# EAGLE design WindVane_1 (EAGLE 7.6.0)
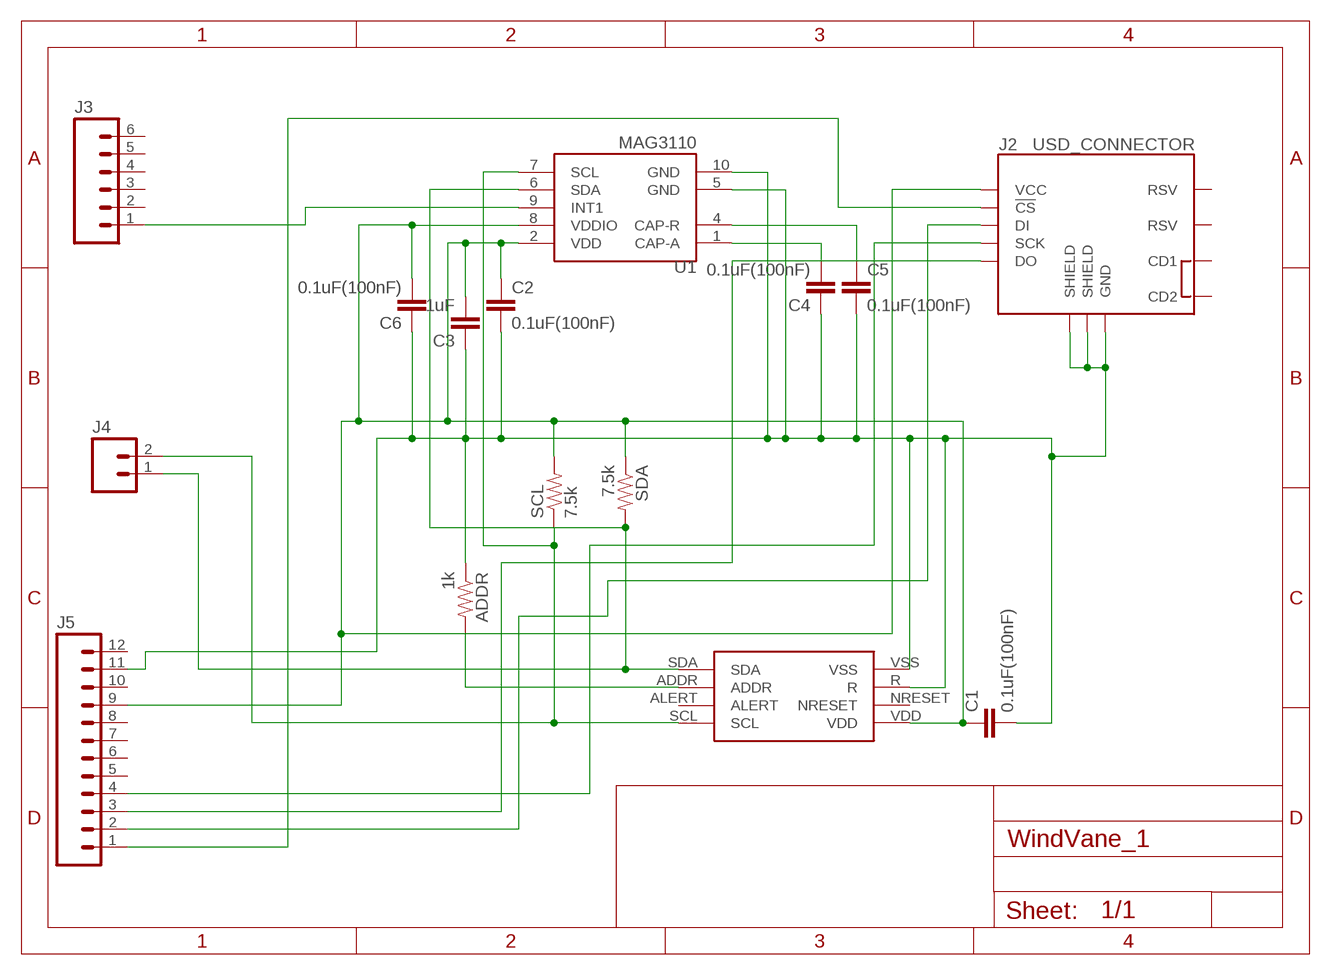
[diagram p0: schematic, sheet 1]

## Parts
ADDR  1k  RESISTOR1206  [1206]
C1  0.1uF(100nF)  CAP0603-CAP  [0603-CAP]
C2  0.1uF(100nF)  0.1UF-25V(+80/-20%)(0603)  [0603-CAP]
C3  1uF  CAP0402-CAP  [0402-CAP]
C4  0.1uF(100nF)  0.1UF-25V(+80/-20%)(0603)  [0603-CAP]
C5  0.1uF(100nF)  0.1UF-25V(+80/-20%)(0603)  [0603-CAP]
C6  0.1uF(100nF)  0.1UF-25V(+80/-20%)(0603)  [0603-CAP]
J2  USD_CONNECTOR  [MICRO-SD-SOCKET-PP]
J3  M06NO_SILK_YES_STOP  [1X06_NO_SILK_YES_STOP]
J4  M02PTH  [1X02]
J5  M121X12_NO_SILK_KIT  [1X12_NO_SILK_KIT]
SCL  7.5k  RESISTOR1206  [1206]
SDA  7.5k  RESISTOR1206  [1206]
U1  MAG3110  [DFN-10]
U$1  SHT3X-DISSURFACE_MOUNT  [SHT3X-DIS]

## Nets
N$1: J4.1 SDA.2 U1.6(SDA) U$1.SDA
N$2: J2.DI J5.2
N$3: ADDR.1 C1.2 C2.2 C3.1 C4.1 C5.2 C6.1 J2.GND J2.GND1(SHIELD) J2.GND3(SHIELD) J5.11 U1.5(GND) U1.10(GND) U$1.R U$1.VSS
N$4: J4.2 SCL.1 U1.7(SCL) U$1.SCL
N$5: ADDR.2 U$1.ADDR
N$6: C4.2 U1.1(CAP-A)
N$7: J3.1 U1.9(INT1)
N$8: C1.1 C2.1 C3.2 C6.2 J2.VCC J5.9 SCL.2 SDA.1 U1.2(VDD) U1.8(VDDIO) U$1.VDD
N$9: C5.1 U1.4(CAP-R)
N$10: J2.CS(!CS) J5.1
N$11: J2.SCLK(SCK) J5.4
N$12: J2.DO J5.3
Unconnected: J2.CD1 J2.CD2 J2.RSV1(RSV) J2.RSV2(RSV) J3.2 J3.3 J3.4 J3.5 J3.6 J5.5 J5.6 J5.7 J5.8 J5.10 J5.12 U$1.ALERT U$1.NRESET

## Library data of the parts
ADDR SCL SDA = SparkFun-Passives:RESISTOR: Resistor Basic schematic elements and footprints for 0603, 1206, and PTH resistors.
C1 = SparkFun-Passives:CAP: Capacitor Standard 0603 ceramic capacitor, and 0.1" leaded capacitor.
C2 C4-C6 = SparkFun-Capacitors:0.1UF-25V(+80/-20%)(0603): CAP-00810 Ceramic Standard decoupling cap; PROD_ID: CAP-00810; VALUE: 0.1uF
C3 = SparkFun-Capacitors:CAP: Capacitor Standard 0603 ceramic capacitor, and 0.1" leaded capacitor.
J2 = SparkFun-Connectors:USD_CONNECTOR: microSD Socket Push-push type µSD socket. Footprint production proven. Symbol has new and improved layout and naming accuracy. SparkFun Electronics SKU : PRT-00127. tDoc lines correctly indicate media card edge positions when inserting (unlocked, locked, depressed). NOTE: CD1 and CD2 are connected internally; PROD_ID: CONN-07820
J3 = SparkFun-Connectors:M06: Header 6 Standard 6-pin 0.1" header. Use with straight break away headers (SKU : PRT-00116), right angle break away headers (PRT-00553), swiss pins (PRT-00743), machine pins (PRT-00117), and female headers (PRT-00115). Molex polarized connector foot print use with SKU : PRT-08094 with associated crimp pins and housings. NOTES ON THE VARIANTS LOCK and LOCK_LONGPADS... This footprint was designed to help hold the alignment of a through-hole component (i.e. 6-pin header) while soldering it into place. You may notice that each hole has been shifted either up or down by 0.005 of an inch from it's more standard position (which is a perfectly straight line). This slight alteration caused the pins (the squares in the middle) to touch the edges of the holes. Because they are alternating, it causes a "brace" to hold the component in place. 0.005 has proven to be the perfect amount of "off-center" position when using our standard breakaway headers. Although looks a little odd when you look at the bare footprint, once you have a header in there, the alteration is very hard to notice. Also,if you push a header all the way into place, it is covered up entirely on the bottom side. This idea of altering the position of holes to aid alignment will be further integrated into the Sparkfun Library for other footprints. It can help hold any component with 3 or more connection pins.
J4 = SparkFun-Connectors:M02: Standard 2-pin 0.1" header. Use with - straight break away headers ( PRT-00116) - right angle break away headers (PRT-00553) - swiss pins (PRT-00743) - machine pins (PRT-00117) - female headers (PRT-00115) Molex polarized connector foot print use with: PRT-08233 with associated crimp pins and housings. 2.54_SCREWTERM for use with PRT-10571. 3.5mm Screw Terminal footprints for PRT-08084 5mm Screw Terminal footprints for use with PRT-08432
J5 = SparkFun-Connectors:M12: Header 12 Standard 12-pin 0.1" header. Use with straight break away headers (SKU : PRT-00116), right angle break away headers (PRT-00553), swiss pins (PRT-00743), machine pins (PRT-00117), and female headers (PRT-00115).
U1 = SparkFun-Sensors:MAG3110: 3-axis digital (I2C) magnetometer
U$1 = WindVane:SHT3X-DIS

## Board
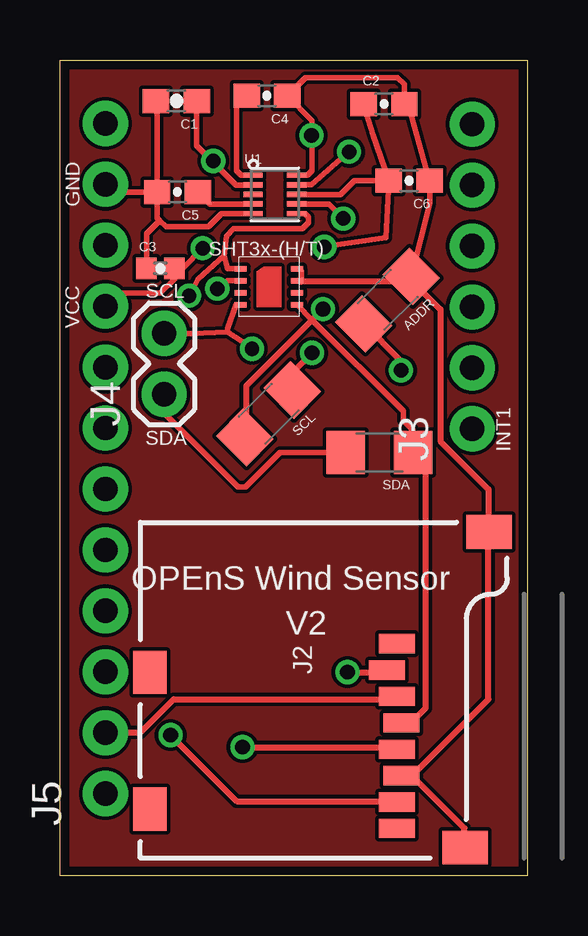
[diagram p1: board, top side]
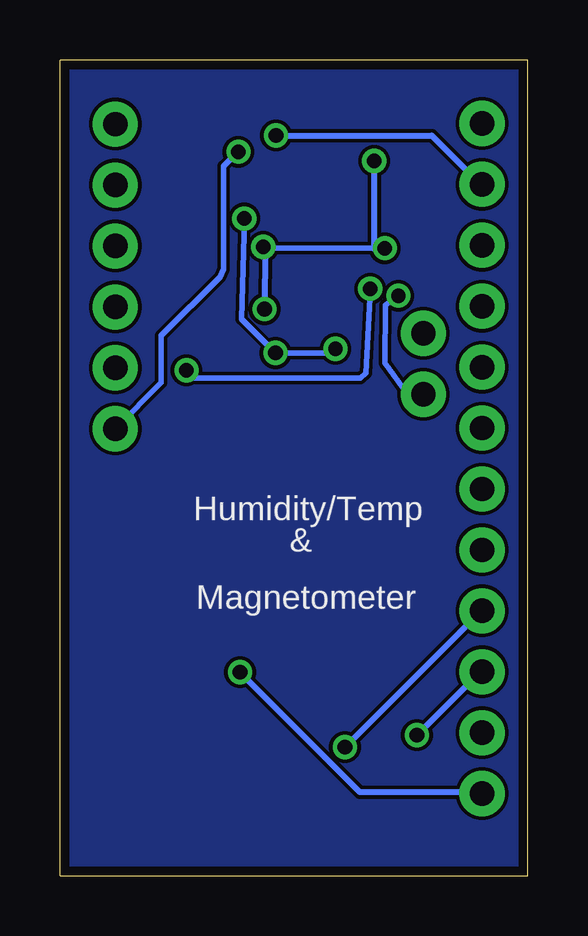
[diagram p2: board, bottom side, seen from below]

Size 19.5 x 34 mm. Coordinates in mm from the lower left corner, seen from the top.
Outline: 19.5,0 19.5,34 0,34 0,0 19.5,0
Copper layers (1*16): Top 0.035mm / dielectric 1.5mm / Bottom 0.035mm
Design rules "default *": minimum track width 5mil, minimum drill 12mil, track to track 6mil, track to pad 6mil, pad to pad 8mil, via to via 8mil, smd to smd 8mil, copper to edge 15mil, drill to drill 8mil, minimum pad ring 10mil, minimum via ring 8mil, stop-mask expansion 4mil, vias tented up to drill 0mil, thermal gap 10mil

### Footprints (pad centres in the part's own frame; a part is rotated, then mirrored left to right if it is on the bottom)
1206 = smd 1.6 x 1.8: 1 -1.4,0; 2 1.4,0
0603-CAP = smd 1.1 x 1: 1 -0.85,0; 2 0.85,0
0402-CAP = smd 0.85 x 0.9: 1 -0.58,0; 2 0.58,0
MICRO-SD-SOCKET-PP = smd 1.8 x 1.4: CD1 -2.05,0.4; CD2 -7.75,0.4 | smd 0.8 x 1.5: CS -7.84,10.3; DI -6.74,10.7; DO -2.34,10.7; GND -3.44,10.9; RSV1 -8.94,10.7; RSV2 -1.24,10.7; SCLK -4.54,10.7; VCC -5.64,10.9 | smd 1.4 x 1.9: GND1 -13.6,14.55; GND3 -0.45,13.55
1X06_NO_SILK_YES_STOP = drill 1.016 pad 1.88: 1 0,0; 2 2.54,0; 3 5.08,0; 4 7.62,0; 5 10.16,0; 6 12.7,0
1X02 = drill 1.016 pad 1.88: 1 0,0; 2 2.54,0
1X12_NO_SILK_KIT = drill 1.016 pad 1.88: 1 0,0; 2 2.54,0; 3 5.08,0; 4 7.62,0; 5 10.16,0; 6 12.7,0; 7 15.24,0; 8 17.78,0; 9 20.32,0; 10 22.86,0; 11 25.4,0; 12 27.94,0
DFN-10 = smd 0.8 x 0.22: 1 -0.91,0.8; 2 -0.91,0.4; 3 -0.91,0; 4 -0.91,-0.4; 5 -0.91,-0.8; 6 0.91,-0.8; 7 0.91,-0.4; 8 0.91,0; 9 0.91,0.4; 10 0.91,0.8
SHT3X-DIS = smd 0.55 x 0.25: ADDR 0.075,1.5; ALERT 0.075,1; NRESET 2.425,1; R 2.425,1.5; SCL 0.075,0.5; SDA 0.075,2; VDD 2.425,0.5; VSS 2.425,2

### Placement (x,y rotation side)
ADDR  13.66,23.99 225 top
C1  4.85,32.29 180 top
C2  13.52,32.17 0 top
C3  4.19,25.31 0 top
C4  8.63,32.51 180 top
C5  4.9,28.5 180 top
C6  14.56,28.97 180 top
J2  3.34,0.73 270 top
J3  17.2,18.62 90 top
J4  4.34,20.06 90 top
J5  1.9,3.41 90 top
SCL  8.7,19.25 225 top
SDA  13.32,17.64 180 top
U1  8.96,28.39 0 top
U$1  7.46,23.29 0 top

### Tracks (layer width: path | path; a pad name or v marks a point on that pad's centre or on a via)
GND
  pour Bottom: 0,34 19.5,34 19.5,34 19.5,0 0,0
  pour Top: 0,34 19.5,34 19.5,0 0,0 0,0.01
N$1  (via drill 0.6)
  Top 0.225: U1.6 10.22,27.59 10.37,27.45 10.37,27.23 10.11,26.97 7.24,26.97 6.94,26.66 6.84,25.84 | 6.84,25.84 6.98,25.3 U$1.SDA | SDA.2 9.18,17.63 7.73,16.19 7.43,16.19 4.33,19.3 4.33,20.05 J4.1 | v5.39,24.18 5.75,24.87 6.84,25.84
  Bottom 0.225: J4.1 5,20.06 5.94,21.38 5.94,23.79 v5.39,24.18
N$2
  Top 0.254: J2.DI 13.99,7.35 4.74,7.35 3.37,5.98 1.99,5.98 J5.2
N$3  (via drill 0.61)
  Top 0.225: C5.2 4.05,32.24 C1.2 | U1.10 10.33,29.2 10.52,29.39 10.52,30.85 10.52,31.47 C4.1 10.24,33.27 14.08,33.27 14.37,32.98 C2.2 14.57,31.96 C6.1 15.43,28.02 ADDR.1 | U1.5 6.74,27.59 6.19,27.05 4.43,27.05 4.16,27.31 | 4.16,27.31 4.05,27.41 C5.2 | C5.2 2.21,28.5 J5.11 | C3.1 3.61,26.76 4.16,27.31
  Top 0.254: 10.05,24.76 10.05,25.21 U$1.VSS | 10.05,24.76 14.62,24.76 ADDR.1 14.74,24.73 15.87,23.6 15.87,18.1 17.87,16.1 17.87,14.35 J2.GND1 17.87,14.23 17.87,7.35 14.74,4.23 J2.GND 14.37,4.1 14.74,4.1 16.87,1.98 16.87,1.23 J2.GND3 | 10.05,24.76 U$1.R | v10.49,30.85 10.52,30.85
  Bottom 0.254: v10.49,30.85 3.99,30.85 1.99,28.85 J5.11
N$4  (via drill 0.6, 0.61)
  Top 0.225: J4.2 5.5,22.6 6.98,22.65 | 6.98,22.65 6.98,22.8 7.34,23.8 U$1.SCL | v8.01,21.96 7.87,22.09 6.98,22.65 | U1.7 11.22,28 v11.81,27.39
  Top 0.254: v10.51,21.79 9.83,21.1 9.83,20.41 SCL.1
  Bottom 0.225: v8.01,21.96 8.33,21.79 v10.51,21.79 11.93,23.2 v11.81,27.39
  Bottom 0.254: 4.57,22.7 J4.2
N$5  (via drill 0.6)
  Top 0.225: U$1.ADDR 6.99,24.8 v6.56,24.47 | v14.23,21.06 14.23,21.45 ADDR.2
  Bottom 0.225: v6.56,24.47 6.75,20.95 6.96,20.73 13.9,20.73 v14.23,21.06
N$6
  Top 0.225: U1.1 7.56,29.2 7.37,29.39 7.37,32.09 C4.2
N$7  (via drill 0.6)
  Top 0.225: U1.9 10.49,28.8 v12.05,30.17
  Bottom 0.205: 15.27,20.55 J3.1
  Bottom 0.225: 15.27,20.55 15.27,22.51 12.83,24.95 12.68,25.28 12.68,29.57 12.07,30.17 v12.05,30.17
N$8  (via drill 0.6, 0.61)
  Top 0.225: C1.1 5.7,30.43 6.37,29.76 7.34,28.79 U1.2 | C2.1 13.06,30.88 C6.2 | U1.8 11.69,28.39 12.27,28.98 C6.2 | J5.9 2.44,24.27 4.18,24.27 4.77,24.87 C3.2 5.11,25.31 v5.95,26.15 | v11.02,26.21 13.6,26.59 C6.2 | SDA.1 14.72,18.56 14.33,18.96 14.33,19.36 10.52,23.16 U$1.VDD
  Top 0.254: v6.4,29.79 6.37,29.76 | SCL.2 7.77,18.36 7.77,20.41 10.52,23.16 v10.97,23.61 | J2.VCC 14.37,6.48 14.74,6.48 15.24,6.98 15.24,17.1 14.74,17.6 SDA.1
  Bottom 0.225: v5.95,26.15 11.02,26.15 v11.02,26.21
  Bottom 0.254: v6.4,29.79 6.4,26.13 v5.95,26.15 | v10.97,23.61 10.91,26.13 v11.02,26.21
N$9
  Top 0.225: U1.4 6.26,28 C5.1
N$10  (via drill 0.61)
  Top 0.254: v11.99,8.48 13.62,8.48 J2.CS
  Bottom 0.254: v11.99,8.48 6.99,3.48 1.99,3.48 J5.1
N$11  (via drill 0.61)
  Top 0.254: v7.62,5.35 13.99,5.35 J2.SCLK
  Bottom 0.254: v7.62,5.35 1.99,10.98 J5.4
N$12  (via drill 0.61)
  Top 0.254: v4.62,5.85 7.37,3.1 13.99,3.1 J2.DO
  Bottom 0.254: v4.62,5.85 1.99,8.48 J5.3

### Text on the board
tPlace: GND | SCL | VCC | SDA | INT1 | OPEnS Wind Sensor | V2
bPlace: Humidity/Temp | & | Magnetometer